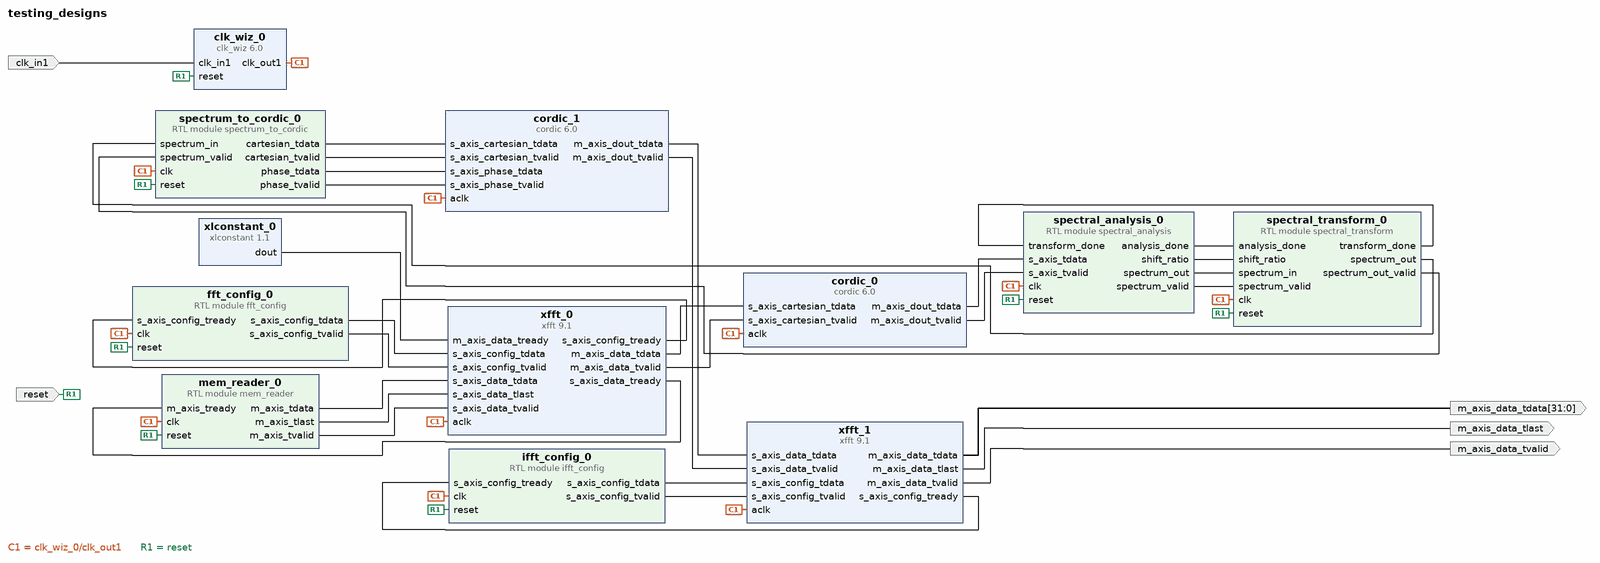
[diagram p0: block diagram of the top level]
# Vivado block design testing_designs, xc7k70tfbv676-1, Vivado 2023.2.2
create_bd_design testing_designs

create_bd_port -dir I -type rst reset
set_property -dict {CONFIG.POLARITY ACTIVE_HIGH} [get_bd_ports reset]
create_bd_port -dir I -type clk clk_in1
set_property -dict {CONFIG.FREQ_HZ 100000000} [get_bd_ports clk_in1]
create_bd_port -dir O -from 31 -to 0 m_axis_data_tdata
create_bd_port -dir O m_axis_data_tlast
create_bd_port -dir O m_axis_data_tvalid

create_bd_cell -type ip -vlnv xilinx.com:ip:clk_wiz:6.0 clk_wiz_0
create_bd_cell -type module -reference mem_reader mem_reader_0
create_bd_cell -type ip -vlnv xilinx.com:ip:xfft:9.1 xfft_0
set_property -dict [list \
  CONFIG.data_format fixed_point \
  CONFIG.implementation_options pipelined_streaming_io \
  CONFIG.input_width 16 \
  CONFIG.number_of_stages_using_block_ram_for_data_and_phase_factors 3 \
  CONFIG.output_ordering natural_order \
  CONFIG.target_clock_frequency 100 \
] [get_bd_cells xfft_0]
create_bd_cell -type module -reference fft_config fft_config_0
create_bd_cell -type ip -vlnv xilinx.com:ip:xlconstant:1.1 xlconstant_0
create_bd_cell -type ip -vlnv xilinx.com:ip:cordic:6.0 cordic_0
set_property -dict [list \
  CONFIG.Compensation_Scaling LUT_based \
  CONFIG.Data_Format SignedFraction \
  CONFIG.Functional_Selection Translate \
  CONFIG.Input_Width 16 \
  CONFIG.Round_Mode Nearest_Even \
] [get_bd_cells cordic_0]
create_bd_cell -type module -reference spectral_analysis spectral_analysis_0
create_bd_cell -type module -reference spectral_transform spectral_transform_0
create_bd_cell -type ip -vlnv xilinx.com:ip:cordic:6.0 cordic_1
create_bd_cell -type module -reference ifft_config ifft_config_0
create_bd_cell -type module -reference spectrum_to_cordic spectrum_to_cordic_0
create_bd_cell -type ip -vlnv xilinx.com:ip:xfft:9.1 xfft_1
set_property -dict [list \
  CONFIG.data_format fixed_point \
  CONFIG.implementation_options pipelined_streaming_io \
  CONFIG.input_width 16 \
  CONFIG.number_of_stages_using_block_ram_for_data_and_phase_factors 3 \
  CONFIG.output_ordering natural_order \
  CONFIG.target_clock_frequency 100 \
] [get_bd_cells xfft_1]

# ---- connections ----

connect_bd_net -net clk_in1_1 [get_bd_ports clk_in1] [get_bd_pins clk_wiz_0/clk_in1]
connect_bd_net [get_bd_pins clk_wiz_0/clk_out1] \
  [get_bd_pins xfft_0/aclk] [get_bd_pins fft_config_0/clk] [get_bd_pins mem_reader_0/clk] [get_bd_pins cordic_0/aclk] \
  [get_bd_pins spectral_analysis_0/clk] [get_bd_pins cordic_1/aclk] [get_bd_pins ifft_config_0/clk] \
  [get_bd_pins spectrum_to_cordic_0/clk] [get_bd_pins spectral_transform_0/clk] [get_bd_pins xfft_1/aclk]
connect_bd_net [get_bd_pins cordic_0/m_axis_dout_tdata] [get_bd_pins spectral_analysis_0/s_axis_tdata]
connect_bd_net [get_bd_pins cordic_0/m_axis_dout_tvalid] [get_bd_pins spectral_analysis_0/s_axis_tvalid]
connect_bd_net [get_bd_pins cordic_1/m_axis_dout_tdata] [get_bd_pins xfft_1/s_axis_data_tdata]
connect_bd_net [get_bd_pins cordic_1/m_axis_dout_tvalid] [get_bd_pins xfft_1/s_axis_data_tvalid]
connect_bd_net [get_bd_pins fft_config_0/s_axis_config_tdata] [get_bd_pins xfft_0/s_axis_config_tdata]
connect_bd_net [get_bd_pins fft_config_0/s_axis_config_tvalid] [get_bd_pins xfft_0/s_axis_config_tvalid]
connect_bd_net [get_bd_pins ifft_config_0/s_axis_config_tdata] [get_bd_pins xfft_1/s_axis_config_tdata]
connect_bd_net [get_bd_pins ifft_config_0/s_axis_config_tvalid] [get_bd_pins xfft_1/s_axis_config_tvalid]
connect_bd_net [get_bd_pins mem_reader_0/m_axis_tdata] [get_bd_pins xfft_0/s_axis_data_tdata]
connect_bd_net [get_bd_pins mem_reader_0/m_axis_tlast] [get_bd_pins xfft_0/s_axis_data_tlast]
connect_bd_net [get_bd_pins mem_reader_0/m_axis_tvalid] [get_bd_pins xfft_0/s_axis_data_tvalid]
connect_bd_net [get_bd_ports reset] \
  [get_bd_pins clk_wiz_0/reset] [get_bd_pins fft_config_0/reset] [get_bd_pins mem_reader_0/reset] \
  [get_bd_pins spectral_analysis_0/reset] [get_bd_pins ifft_config_0/reset] [get_bd_pins spectrum_to_cordic_0/reset] \
  [get_bd_pins spectral_transform_0/reset]
connect_bd_net [get_bd_pins spectral_analysis_0/analysis_done] [get_bd_pins spectral_transform_0/analysis_done]
connect_bd_net [get_bd_pins spectral_analysis_0/shift_ratio] [get_bd_pins spectral_transform_0/shift_ratio]
connect_bd_net [get_bd_pins spectral_analysis_0/spectrum_out] [get_bd_pins spectral_transform_0/spectrum_in]
connect_bd_net [get_bd_pins spectral_analysis_0/spectrum_valid] [get_bd_pins spectral_transform_0/spectrum_valid]
connect_bd_net [get_bd_pins spectral_transform_0/spectrum_out] [get_bd_pins spectrum_to_cordic_0/spectrum_in]
connect_bd_net [get_bd_pins spectral_transform_0/spectrum_out_valid] [get_bd_pins spectrum_to_cordic_0/spectrum_valid]
connect_bd_net [get_bd_pins spectral_transform_0/transform_done] [get_bd_pins spectral_analysis_0/transform_done]
connect_bd_net [get_bd_pins spectrum_to_cordic_0/cartesian_tdata] [get_bd_pins cordic_1/s_axis_cartesian_tdata]
connect_bd_net [get_bd_pins spectrum_to_cordic_0/cartesian_tvalid] [get_bd_pins cordic_1/s_axis_cartesian_tvalid]
connect_bd_net [get_bd_pins spectrum_to_cordic_0/phase_tdata] [get_bd_pins cordic_1/s_axis_phase_tdata]
connect_bd_net [get_bd_pins spectrum_to_cordic_0/phase_tvalid] [get_bd_pins cordic_1/s_axis_phase_tvalid]
connect_bd_net [get_bd_pins xfft_0/m_axis_data_tdata] [get_bd_pins cordic_0/s_axis_cartesian_tdata]
connect_bd_net [get_bd_pins xfft_0/m_axis_data_tvalid] [get_bd_pins cordic_0/s_axis_cartesian_tvalid]
connect_bd_net [get_bd_pins xfft_0/s_axis_config_tready] [get_bd_pins fft_config_0/s_axis_config_tready]
connect_bd_net [get_bd_pins xfft_0/s_axis_data_tready] [get_bd_pins mem_reader_0/m_axis_tready]
connect_bd_net [get_bd_pins xfft_1/m_axis_data_tdata] [get_bd_ports m_axis_data_tdata]
connect_bd_net [get_bd_pins xfft_1/m_axis_data_tlast] [get_bd_ports m_axis_data_tlast]
connect_bd_net [get_bd_pins xfft_1/m_axis_data_tvalid] [get_bd_ports m_axis_data_tvalid]
connect_bd_net [get_bd_pins xfft_1/s_axis_config_tready] [get_bd_pins ifft_config_0/s_axis_config_tready]
connect_bd_net [get_bd_pins xlconstant_0/dout] [get_bd_pins xfft_0/m_axis_data_tready]

validate_bd_design
save_bd_design
